# Altium schematic sheet FPGA_Power.SchDoc
size A3
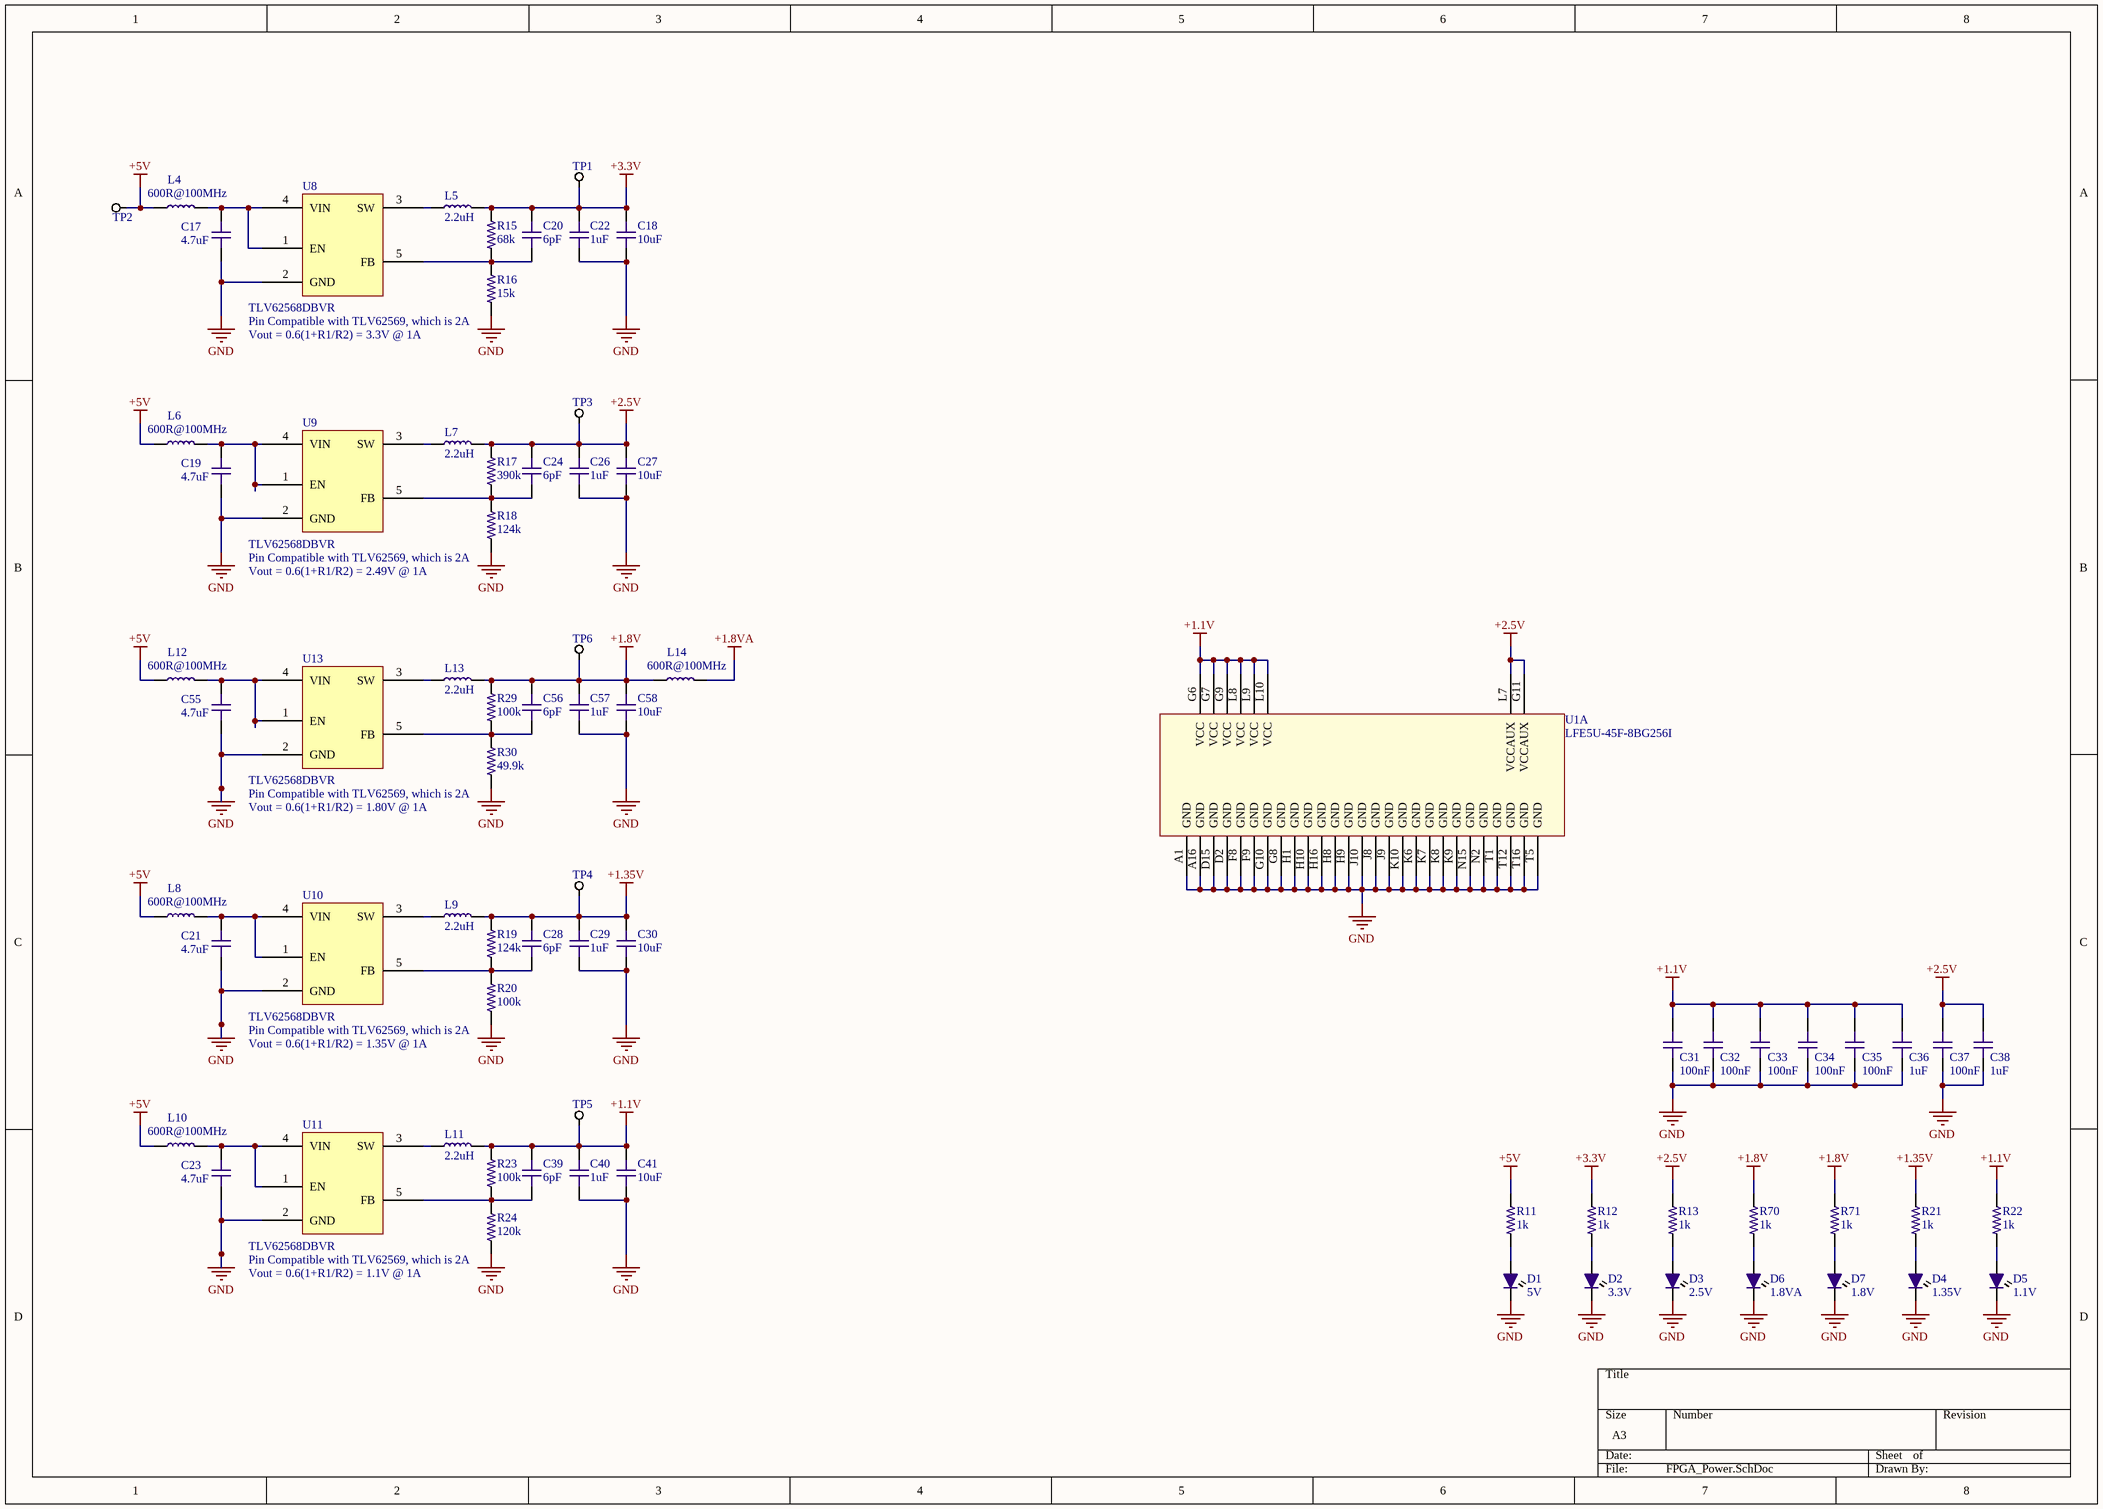
[diagram p0: FPGA_Power.SchDoc]

## Parts
C17  value 4.7uF  [C0603-HIGH-DENSITY]  (hidden comment: 4.7uF, 25V, X5R, 0603)
C18  value 10uF  [C0603-HIGH-DENSITY]  (hidden comment: C0603 10uF 10V X5R)
C19  value 4.7uF  [C0603-HIGH-DENSITY]  (hidden comment: 4.7uF, 25V, X5R, 0603)
C20  value 6pF  [C0603-HIGH-DENSITY]  (hidden comment: CL10C060DB8NNNC)
C21  value 4.7uF  [C0603-HIGH-DENSITY]  (hidden comment: 4.7uF, 25V, X5R, 0603)
C22  value 1uF  [C0603-HIGH-DENSITY]  (hidden comment: C0603 1uF 25V X7R)
C23  value 4.7uF  [C0603-HIGH-DENSITY]  (hidden comment: 4.7uF, 25V, X5R, 0603)
C24  value 6pF  [C0603-HIGH-DENSITY]  (hidden comment: CL10C060DB8NNNC)
C26  value 1uF  [C0603-HIGH-DENSITY]  (hidden comment: C0603 1uF 25V X7R)
C27  value 10uF  [C0603-HIGH-DENSITY]  (hidden comment: C0603 10uF 10V X5R)
C28  value 6pF  [C0603-HIGH-DENSITY]  (hidden comment: CL10C060DB8NNNC)
C29  value 1uF  [C0603-HIGH-DENSITY]  (hidden comment: C0603 1uF 25V X7R)
C30  value 10uF  [C0603-HIGH-DENSITY]  (hidden comment: C0603 10uF 10V X5R)
C31  value 100nF  [C0603-HIGH-DENSITY]  (hidden comment: C0603 100nF 25V X7R)
C32  value 100nF  [C0603-HIGH-DENSITY]  (hidden comment: C0603 100nF 25V X7R)
C33  value 100nF  [C0603-HIGH-DENSITY]  (hidden comment: C0603 100nF 25V X7R)
C34  value 100nF  [C0603-HIGH-DENSITY]  (hidden comment: C0603 100nF 25V X7R)
C35  value 100nF  [C0603-HIGH-DENSITY]  (hidden comment: C0603 100nF 25V X7R)
C36  value 1uF  [C0603-HIGH-DENSITY]  (hidden comment: C0603 1uF 25V X7R)
C37  value 100nF  [C0603-HIGH-DENSITY]  (hidden comment: C0603 100nF 25V X7R)
C38  value 1uF  [C0603-HIGH-DENSITY]  (hidden comment: C0603 1uF 25V X7R)
C39  value 6pF  [C0603-HIGH-DENSITY]  (hidden comment: CL10C060DB8NNNC)
C40  value 1uF  [C0603-HIGH-DENSITY]  (hidden comment: C0603 1uF 25V X7R)
C41  value 10uF  [C0603-HIGH-DENSITY]  (hidden comment: C0603 10uF 10V X5R)
C55  value 4.7uF  [C0603-HIGH-DENSITY]  (hidden comment: 4.7uF, 25V, X5R, 0603)
C56  value 6pF  [C0603-HIGH-DENSITY]  (hidden comment: CL10C060DB8NNNC)
C57  value 1uF  [C0603-HIGH-DENSITY]  (hidden comment: C0603 1uF 25V X7R)
C58  value 10uF  [C0603-HIGH-DENSITY]  (hidden comment: C0603 10uF 10V X5R)
D1  5V  [LED0603-IPC]
D2  3.3V  [LED0603-IPC]
D3  2.5V  [LED0603-IPC]
D4  1.35V  [LED0603-IPC]
D5  1.1V  [LED0603-IPC]
D6  1.8VA  [LED0603-IPC]
D7  1.8V  [LED0603-IPC]
L4  value 600R@100MHz  [L0603]  (hidden comment: Ferrite Bead)
L5  value 2.2uH  [L1008]  (hidden comment: SDEM25201B-2R2MS)
L6  value 600R@100MHz  [L0603]  (hidden comment: Ferrite Bead)
L7  value 2.2uH  [L1008]  (hidden comment: SDEM25201B-2R2MS)
L8  value 600R@100MHz  [L0603]  (hidden comment: Ferrite Bead)
L9  value 2.2uH  [L1008]  (hidden comment: SDEM25201B-2R2MS)
L10  value 600R@100MHz  [L0603]  (hidden comment: Ferrite Bead)
L11  value 2.2uH  [L1008]  (hidden comment: SDEM25201B-2R2MS)
L12  value 600R@100MHz  [L0603]  (hidden comment: Ferrite Bead)
L13  value 2.2uH  [L1008]  (hidden comment: SDEM25201B-2R2MS)
L14  value 600R@100MHz  [L0603]  (hidden comment: Ferrite Bead)
R11  value 1k  [R0603-IPC-1K]  (hidden comment: R0603 1K 1%)
R12  value 1k  [R0603-IPC-1K]  (hidden comment: R0603 1K 1%)
R13  value 1k  [R0603-IPC-1K]  (hidden comment: R0603 1K 1%)
R15  value 68k  [R0603-HIGH-DENSITY]  (hidden comment: R0603 68K 1%)
R16  value 15k  [R0603-HIGH-DENSITY]  (hidden comment: R0603 15K 1%)
R17  value 390k  [R0603-HIGH-DENSITY]  (hidden comment: R0603 390k 0.1%)
R18  value 124k  [R0603-HIGH-DENSITY]  (hidden comment: R0603 124K 1%)
R19  value 124k  [R0603-HIGH-DENSITY]  (hidden comment: R0603 124K 1%)
R20  value 100k  [R0603-HIGH-DENSITY]  (hidden comment: R0603 100K 1%)
R21  value 1k  [R0603-IPC-1K]  (hidden comment: R0603 1K 1%)
R22  value 1k  [R0603-IPC-1K]  (hidden comment: R0603 1K 1%)
R23  value 100k  [R0603-HIGH-DENSITY]  (hidden comment: R0603 100K 1%)
R24  value 120k  [R0603-HIGH-DENSITY]  (hidden comment: R0603 120k 1%)
R29  value 100k  [R0603-HIGH-DENSITY]  (hidden comment: R0603 100K 1%)
R30  value 49.9k  [R0603-HIGH-DENSITY]  (hidden comment: R0603 49.9K 1%)
R70  value 1k  [R0603-IPC-1K]  (hidden comment: R0603 1K 1%)
R71  value 1k  [R0603-IPC-1K]  (hidden comment: R0603 1K 1%)
TP1  3V3  [Testpoint_TH]  (value not drawn)
TP2  5V0  [Testpoint_TH]  (value not drawn)
TP3  2V5  [Testpoint_TH]  (value not drawn)
TP4  1V35  [Testpoint_TH]  (value not drawn)
TP5  1V1  [Testpoint_TH]  (value not drawn)
TP6  1V8  [Testpoint_TH]  (value not drawn)
U1  LFE5U-45F-8BG256I  [caBGA256]  (part A of 9)
U8  TLV62568DBVR  [DBV0005A]
U9  TLV62568DBVR  [DBV0005A]
U10  TLV62568DBVR  [DBV0005A]
U11  TLV62568DBVR  [DBV0005A]
U13  TLV62568DBVR  [DBV0005A]

## Nets
+1.1V: C31.2 C32.2 C33.2 C34.2 C35.2 C36.2 C39.2 C40.2 C41.2 L11.2 R22.2 R23.2 TP5.1 U1.G6(VCC) U1.G7(VCC) U1.G9(VCC) U1.L8(VCC) U1.L9(VCC) U1.L10(VCC)
+1.8V: C56.2 C57.2 C58.2 L13.2 L14.1 R29.2 R70.2 R71.2 TP6.1
+1.8VA: L14.2
+1.35V: C28.2 C29.2 C30.2 L9.2 R19.2 R21.2 TP4.1
+2.5V: C24.2 C26.2 C27.2 C37.2 C38.2 L7.2 R13.2 R17.2 TP3.1 U1.G11(VCCAUX) U1.L7(VCCAUX)
+3.3V: C18.2 C20.2 C22.2 L5.2 R12.2 R15.2 TP1.1
+5V: L4.1 L6.1 L8.1 L10.1 L12.1 R11.2 TP2.1
GND: C17.1 C18.1 C19.1 C21.1 C22.1 C23.1 C26.1 C27.1 C29.1 C30.1 C31.1 C32.1 C33.1 C34.1 C35.1 C36.1 C37.1 C38.1 C40.1 C41.1 C55.1 C57.1 C58.1 D1.K D2.K D3.K D4.K D5.K D6.K D7.K R16.1 R18.1 R20.1 R24.1 R30.1 U1.A1(GND) U1.A16(GND) U1.D2(GND) U1.D15(GND) U1.F8(GND) U1.F9(GND) U1.G8(GND) U1.G10(GND) U1.H1(GND) U1.H8(GND) U1.H9(GND) U1.H10(GND) U1.H16(GND) U1.J8(GND) U1.J9(GND) U1.J10(GND) U1.K6(GND) U1.K7(GND) U1.K8(GND) U1.K9(GND) U1.K10(GND) U1.N2(GND) U1.N15(GND) U1.T1(GND) U1.T5(GND) U1.T12(GND) U1.T16(GND) U8.2(GND) U9.2(GND) U10.2(GND) U11.2(GND) U13.2(GND)
NetC17_2: C17.2 L4.2 U8.1(EN) U8.4(VIN)
NetC19_2: C19.2 L6.2 U9.1(EN) U9.4(VIN)
NetC20_1: C20.1 R15.1 R16.2 U8.5(FB)
NetC21_2: C21.2 L8.2 U10.1(EN) U10.4(VIN)
NetC23_2: C23.2 L10.2 U11.1(EN) U11.4(VIN)
NetC24_1: C24.1 R17.1 R18.2 U9.5(FB)
NetC28_1: C28.1 R19.1 R20.2 U10.5(FB)
NetC39_1: C39.1 R23.1 R24.2 U11.5(FB)
NetC55_2: C55.2 L12.2 U13.1(EN) U13.4(VIN)
NetC56_1: C56.1 R29.1 R30.2 U13.5(FB)
NetD1_A: D1.A R11.1
NetD2_A: D2.A R12.1
NetD3_A: D3.A R13.1
NetD4_A: D4.A R21.1
NetD5_A: D5.A R22.1
NetD6_A: D6.A R70.1
NetD7_A: D7.A R71.1
NetL5_1: L5.1 U8.3(SW)
NetL7_1: L7.1 U9.3(SW)
NetL9_1: L9.1 U10.3(SW)
NetL11_1: L11.1 U11.3(SW)
NetL13_1: L13.1 U13.3(SW)

## Notes on the sheet
- Vout = 0.6(1+R1/R2) = 3.3V @ 1A
- (near R16) Pin Compatible with TLV62569, which is 2A
- Vout = 0.6(1+R1/R2) = 2.49V @ 1A
- (near R18) Pin Compatible with TLV62569, which is 2A
- Vout = 0.6(1+R1/R2) = 1.80V @ 1A
- (near R30) Pin Compatible with TLV62569, which is 2A
- Vout = 0.6(1+R1/R2) = 1.35V @ 1A
- (near R20) Pin Compatible with TLV62569, which is 2A
- (near R24) Pin Compatible with TLV62569, which is 2A
- Vout = 0.6(1+R1/R2) = 1.1V @ 1A

## Library data of the parts
C17 C19 C21 C23 C55 = C0603 4.7uF 25V X5R: Chip Capacitor, 0603, 4.7uF, 25V, X5R; EIA Code: X5R; Max. Voltage: 25V; Supplier 1: Digi-Key; Supplier 2: Mouser; Supplier 3: LCSC; Supplier Part Number 1: 490-7203-1-ND; Supplier Part Number 2: 81-GRM188R61E475KE1D; Supplier Part Number 3: C90057
C18 C27 C30 C41 C58 = C0603 10uF 10V X5R: Chip Capacitor, 0603, 10uF, 10V, X5R; EIA Code: X7R; Max. Voltage: 10V; Supplier 1: Digi-Key; Supplier Part Number 1: 490-10474-1-ND
C20 C24 C28 C39 C56 = C0603 6pF 50V C0G: CAP CER 6PF 50V C0G/NP0 0603; EIA Code: C0G; Max. Voltage: 50V; Supplier 1: Digi-Key; Supplier 2: Mouser; Supplier 3: LCSC; Supplier Part Number 1: 1276-2134-1-ND; Supplier Part Number 2: 187-CL10C060DB8NNNC; Supplier Part Number 3: C170142
C22 C26 C29 C36 C38 C40 C57 = C0603 1uF 25V X7R: CAP CER 1UF 25V X7R 0603; EIA Code: X7R; Max. Voltage: 25V; Features: Soft Termination; Supplier 1: Digi-Key; Supplier Part Number 1: 445-173615-1-ND
C31-C35 C37 = C0603 100nF 25V X7R: Chip Capacitor, 0603, 100nF, 25V, X7R; EIA Code: X7R; Max. Voltage: 25V; Supplier 1: Digi-Key; Supplier Part Number 1: 490-1524-1-ND
D1-D7 = LED 0603 Green: LED GREEN CLEAR 0603 SMD; Supplier 1: Digi-Key; Supplier Part Number 1: 732-4971-1-ND
L4 L6 L8 L10 L12 L14 = FB 0603 600R @ 100MHz: 600 Ohms @ 100MHz 1 Ferrite Bead 0603 (1608 Metric) 500mA 380mOhm; Supplier 1: Digi-Key; Supplier Part Number 1: 490-1014-1-ND
L5 L7 L9 L11 L13 = SDEM25201B-2R2MS: 2.2µH Shielded Inductor 2.05A 117mOhm Max 1008 (2520 Metric); Supplier 1: Digi-Key; Supplier Part Number 1: 2037-SDEM25201B-2R2MSCT-ND
R11-R13 R21 R22 R70 R71 = R0603 1K 1%: RES SMD 1K OHM 1% 1/10W 0603; Temperature Coefficient: ±100ppm/°C; Operating Temperature: -55°C ~ 155°C; Features: Automotive AEC-Q200; Tolerance: ±1%; Supplier 1: Digi-Key; Supplier Part Number 1: RMCF0603FG1K00CT-ND
R15 = R0603 68K 0.1%: RES SMD 68K OHM 1% 1/5W 0603; Supplier 1: Digi-Key; Supplier Part Number 1: P20181CT-ND
R16 = R0603 15K 1%: RES SMD 15K OHM 1% 1/10W 0603; Supplier 1: Digi-Key; Supplier Part Number 1: RMCF0603FT15K0CT-ND
R17 = R0603 390k 0.1%: RES SMD 390K OHM 0.1% 1/10W 0603; Supplier 1: Digi-Key; Supplier Part Number 1: YAG4542CT-ND
R18 R19 = R0603 124K 1%: RES SMD 124K OHM 1% 1/10W 0603; Supplier 1: Digi-Key; Supplier Part Number 1: RMCF0603FT124KCT-ND
R20 R23 R29 = R0603 100K 1%: RES SMD 100K OHM 1% 1/10W 0603; Supplier 1: Digi-Key; Supplier Part Number 1: RMCF0603FT100KCT-ND
R24 = R0603 120k 1%: RES SMD 120K OHM 1% 1/10W 0603; Power: 0.1W; Temperature Coefficient: ±100ppm/°C; Supplier 1: Digi-Key; Tolerance: ±1%; Features: Automotive AEC-Q200; Operating Temperature: -55°C ~ 155°C; Supplier Part Number 1: RMCF0603FT120KCT-ND
R30 = R0603 49.9K 1%: RES SMD 49.9K OHM 1% 1/10W 0603; Temperature Coefficient: ±100ppm/°C; Features: Automotive AEC-Q200; Operating Temperature: -55°C ~ 155°C; Tolerance: ±1%; Supplier 1: Digi-Key; Supplier Part Number 1: RMCF0603FT49K9CT-ND
TP1-TP6 = Testpoint_TH: Through-hole testpoint hook
U1 = ECP5-45F-CABGA256: Lattice ECP5 45k LUTs / IC FPGA 197 I/O 256CABGA; Supplier 1: Digi-Key; Supplier 2: Mouser; Supplier Part Number 1: 220-2201-ND; Supplier Part Number 2: 842-LFE5U45F8BG256I
U8-U11 U13 = TLV62568: IC REG BUCK ADJ 1A SOT23-5; Supplier 1: Digi-Key; Supplier Part Number 1: 296-47359-1-ND